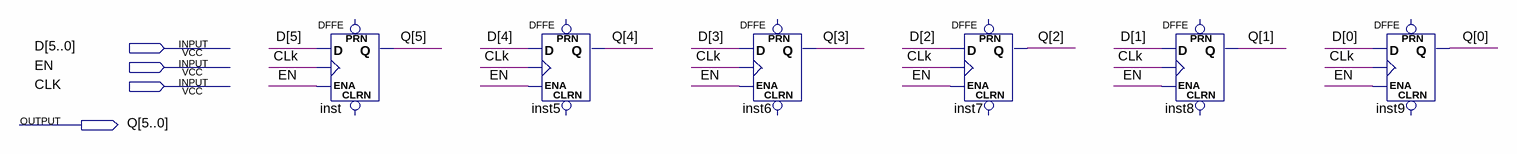
[diagram p0: schematic sheet]
// Quartus schematic DFF_6bit.bdf as structural Verilog: 6 symbols, 4 pins
module DFF_6bit (
  input  [5:0] D,
  input  EN,
  input  CLK,
  output [5:0] Q
);

  DFFE inst (.D(D[5]), .CLK(CLK), .ENA(EN), .Q(Q[5]));  // open: PRN, CLRN
  DFFE inst5 (.D(D[4]), .CLK(CLK), .ENA(EN), .Q(Q[4]));  // open: PRN, CLRN
  DFFE inst6 (.D(D[3]), .CLK(CLK), .ENA(EN), .Q(Q[3]));  // open: PRN, CLRN
  DFFE inst7 (.D(D[2]), .CLK(CLK), .ENA(EN), .Q(Q[2]));  // open: PRN, CLRN
  DFFE inst8 (.D(D[1]), .CLK(CLK), .ENA(EN), .Q(Q[1]));  // open: PRN, CLRN
  DFFE inst9 (.D(D[0]), .CLK(CLK), .ENA(EN), .Q(Q[0]));  // open: PRN, CLRN
endmodule
